# Altium schematic sheet LLC.SchDoc
size 508 x 381 mm
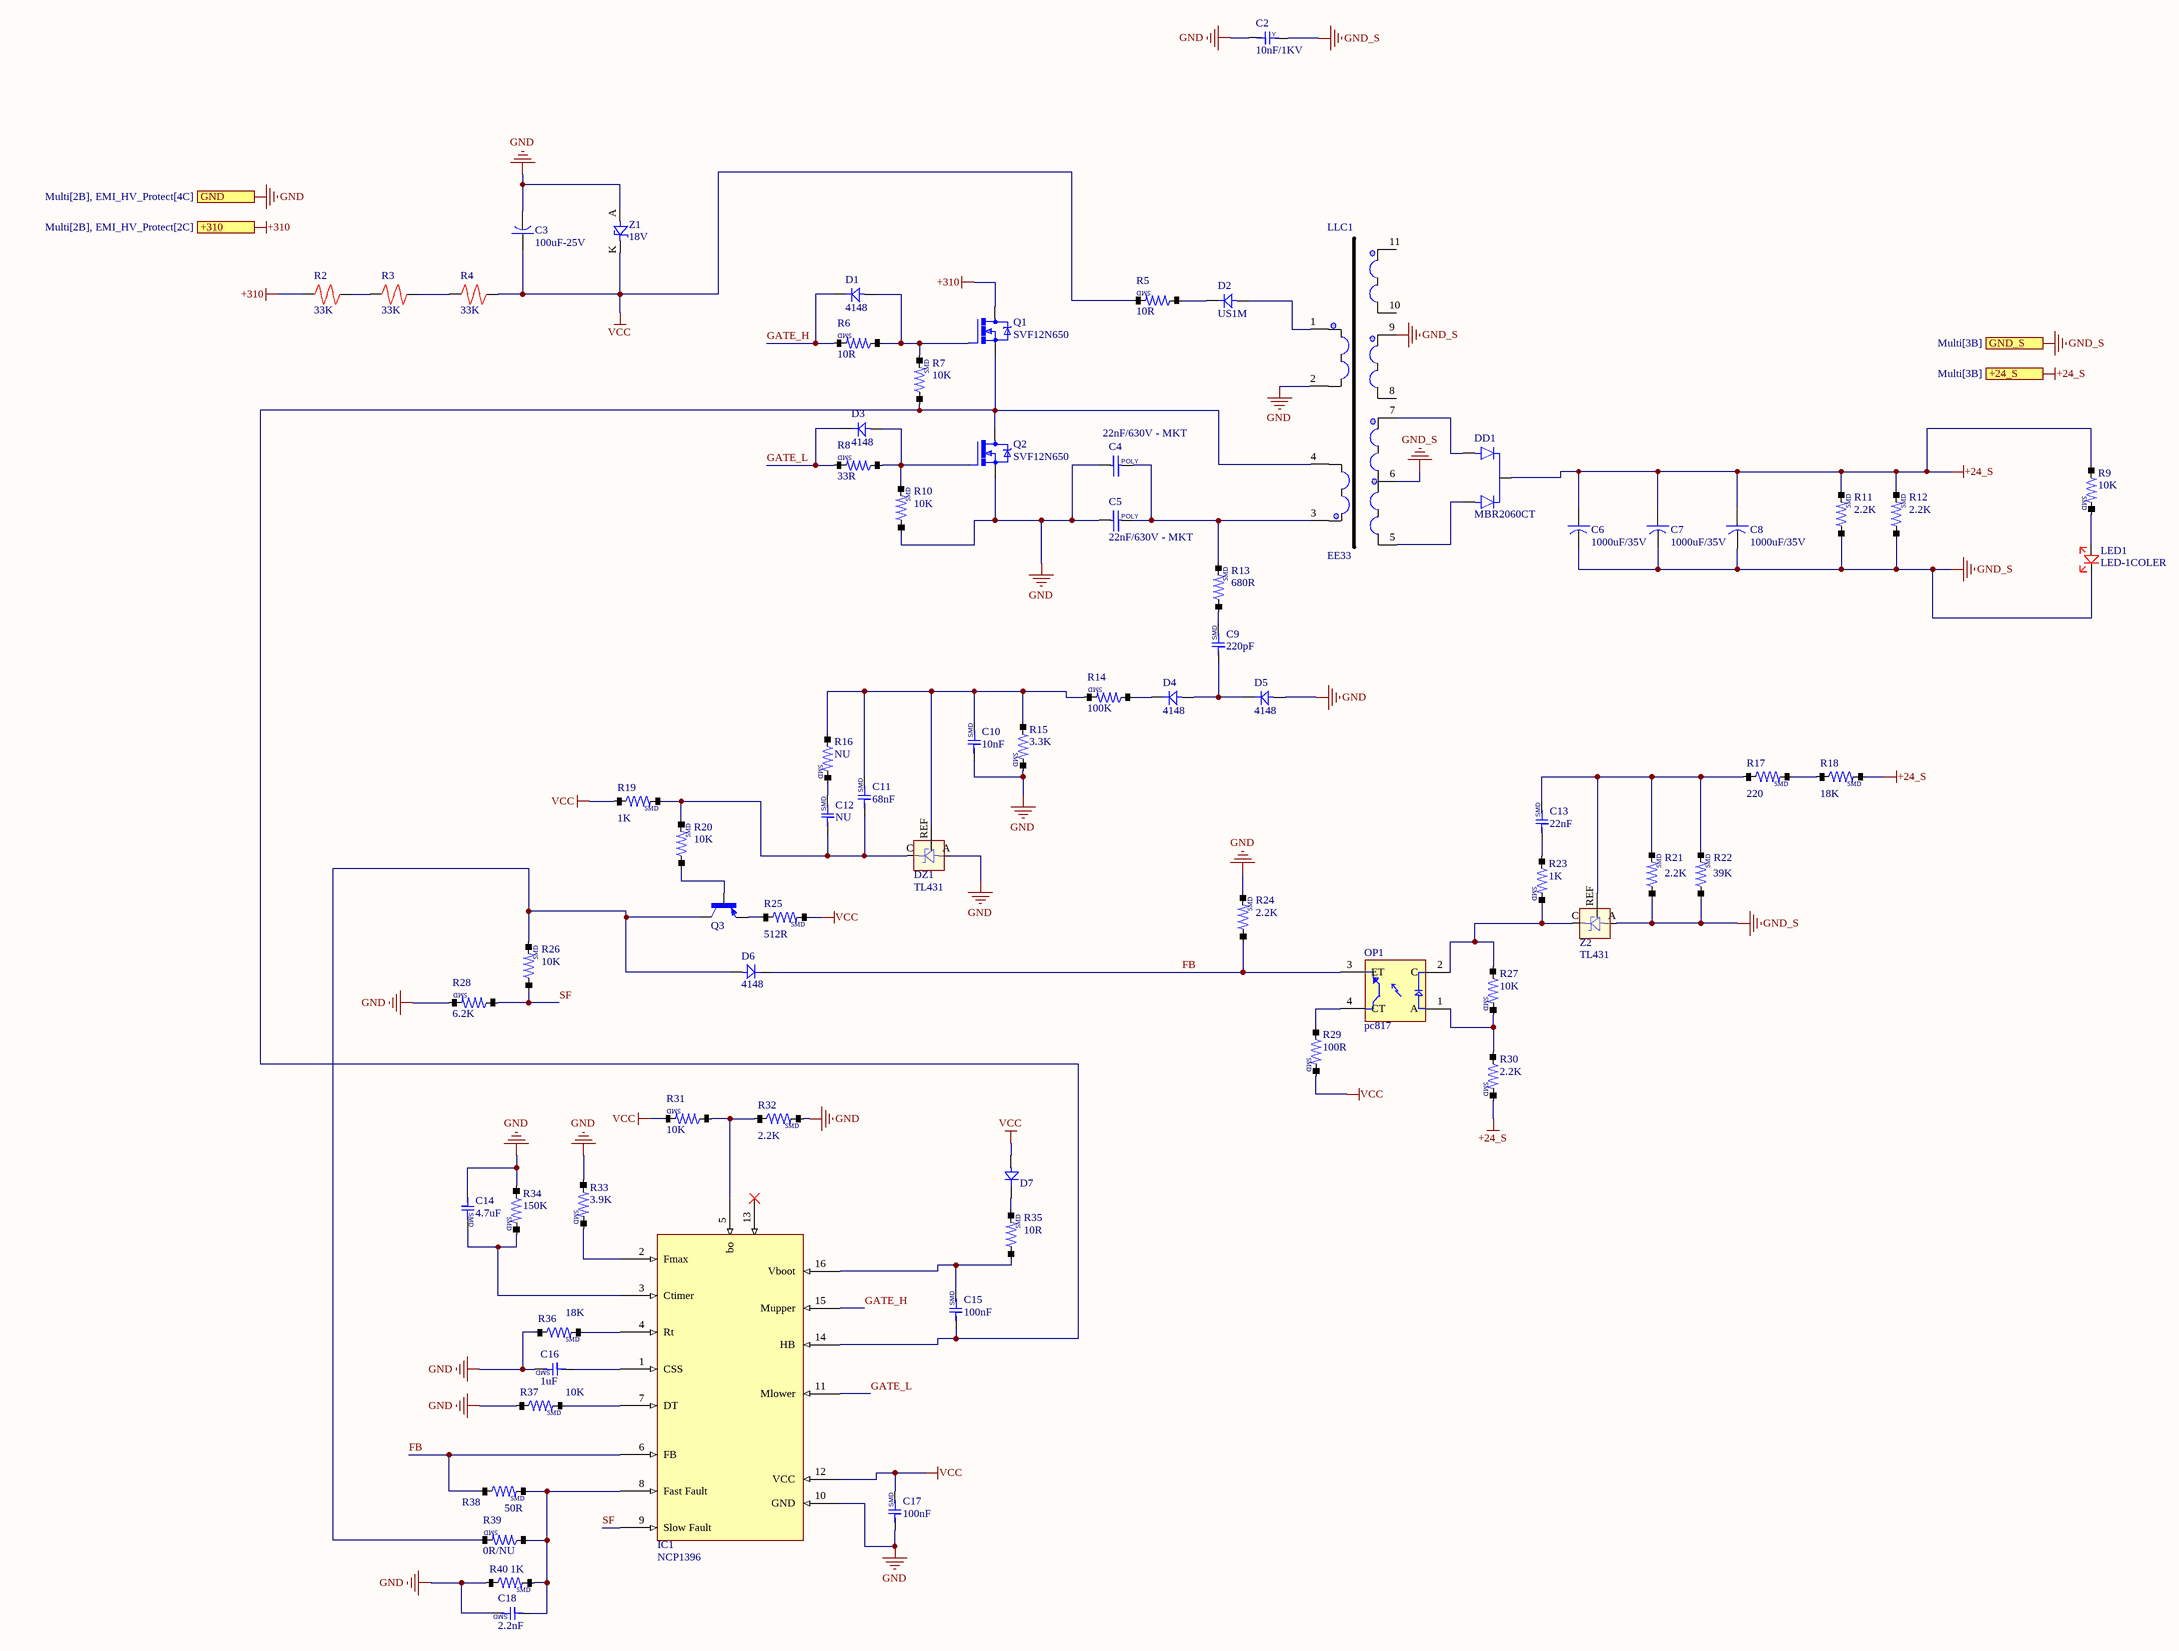
[diagram p0: LLC.SchDoc]

## Parts
C2  10nF/1KV  [CAP_Y_2KV]
C3  100uF-25V  [cap/330u/16v]
C4  22nF/630V - MKT  [CAP-POLY-0.47uF-400V]
C5  22nF/630V - MKT  [CAP-POLY-0.47uF-400V]
C6  1000uF/35V  [CAP-EL_P5MM]
C7  1000uF/35V  [CAP-EL_P5MM]
C8  1000uF/35V  [CAP-EL_P5MM]
C9  220pF  [CAP-0805]
C10  10nF  [CAP-0603]
C11  68nF  [CAP-0603]
C12  NU  [CAP-0603]
C13  22nF  [CAP-0603]
C14  4.7uF  [CAP-0805]
C15  100nF  [CAP-1206]
C16  1uF  [CAP-0805]
C17  100nF  [CAP-0603]
C18  2.2nF  [CAP-0603]
D1  4148  [mini_melf]
D2  US1M  [DIOD/1N4007/SMD]
D3  4148  [mini_melf]
D4  4148  [mini_melf]
D5  4148  [mini_melf]
D6  4148  [mini_melf]
D7  DIOD/RECTIFIERS  [DIOD/1N4007/SMD]  (value not drawn)
DD1  MBR2060CT  [TO220AB]
DZ1  TL431  [TL431]
IC1  NCP1396  [TL494_SMD]
LED1  LED-1COLER  [led/3MM/DIP]
LLC1  EE33  [EE33]
OP1  pc817  [pc817]
Q1  SVF12N650  [TO-220]
Q2  SVF12N650  [TO-220]
Q3  (no value)  [SOT23]
R2  33K  [RES/1W]
R3  33K  [RES/0.25W]
R4  33K  [RES/0.25W]
R5  10R  [RES/1206]
R6  10R  [RES/1206]
R7  10K  [RES/0603]
R8  33R  [RES/1206]
R9  10K  [RES/1206]
R10  10K  [RES/0603]
R11  2.2K  [RES/1206]
R12  2.2K  [RES/1206]
R13  680R  [RES/0603]
R14  100K  [RES/0603]
R15  3.3K  [RES/0603]
R16  NU  [RES/0603]
R17  220  [RES/0603]
R18  18K  [RES/0603]
R19  1K  [RES/0603]
R20  10K  [RES/0603]
R21  2.2K  [RES/0603]
R22  39K  [RES/0603]
R23  1K  [RES/0603]
R24  2.2K  [RES/0603]
R25  512R  [RES/0603]
R26  10K  [RES/0603]
R27  10K  [RES/0603]
R28  6.2K  [RES/0603]
R29  100R  [RES/0603]
R30  2.2K  [RES/0603]
R31  10K  [RES/0603]
R32  2.2K  [RES/0603]
R33  3.9K  [RES/0603]
R34  150K  [RES/0603]
R35  10R  [RES/1206]
R36  18K  [RES/0603]
R37  10K  [RES/0603]
R38  50R  [RES/0603]
R39  0R/NU  [RES/0603]
R40  1K  [RES/0603]
Z1  18V  [DIOD/RS1J]
Z2  TL431  [TL431]

## Ports
+24_S (see Multi[3B]), +310 (see Multi[2B], EMI_HV_Protect[2C]), GND (see Multi[2B], EMI_HV_Protect[4C]), GND_S (see Multi[3B])

## Nets
+24_S: C6.+ C7.+ C8.+ DD1.2(C) R9.1 R11.2 R12.2 R18.2 R30.2 ; port +24_S
+310: Q1.2(D) R2.2 ; port +310
GND: C2.1 C3.- C4.1 C5.1 C10.1 C14.1 C16.2 C17.1 C18.2 D5.A DZ1.A IC1.10(GND) LLC1.2 Q2.3(s) R10.1 R15.2 R24.2 R28.2 R32.2 R33.1 R34.1 R36.1 R37.1 R40.1 Z1.A ; port GND
GND_S: C2.2 C6.- C7.- C8.- LED1.K LLC1.6 LLC1.9 R11.1 R12.1 R21.1 R22.1 Z2.A ; port GND_S
VCC: C3.+ C17.2 D7.A IC1.12(VCC) R4.1 R5.2 R19.1 R25.2 R29.2 R31.2 Z1.K
FB: D6.K IC1.6(FB) OP1.3(ET) R24.1 R38.1
GATE_H: D1.K IC1.15(Mupper) R6.2
GATE_L: D3.K IC1.11(Mlower) R8.2
SF: IC1.9(Slow_Fault) R26.1 R28.1
NetC4_2: C4.2 C5.2 LLC1.3 R13.2
NetC9_1: C9.1 D4.A D5.K
NetC9_2: C9.2 R13.1
NetC10_2: C10.2 C11.2 DZ1.REF R14.2 R15.1 R16.1
NetC11_1: C11.1 C12.1 DZ1.C R19.2 R20.2
NetC12_2: C12.2 R16.2
NetC13_1: C13.1 R23.1
NetC13_2: C13.2 R17.1 R21.2 R22.2 Z2.REF
NetC14_2: C14.2 IC1.3(Ctimer) R34.2
NetC15_1: C15.1 IC1.14(HB) LLC1.4 Q1.3(s) Q2.2(D) R7.1
NetC15_2: C15.2 IC1.16(Vboot) R35.1
NetC16_1: C16.1 IC1.1(CSS)
NetC18_1: C18.1 IC1.8(Fast_Fault) R38.2 R39.1 R40.2
NetD1_A: D1.A Q1.1(G) R6.1 R7.2
NetD2_A: D2.A LLC1.1
NetD2_K: D2.K R5.1
NetD3_A: D3.A Q2.1(G) R8.1 R10.2
NetD4_K: D4.K R14.1
NetD6_A: D6.A Q3.2(C) R26.2 R39.2
NetD7_K: D7.K R35.2
NetDD1_1: DD1.1(A1) LLC1.7
NetDD1_3: DD1.3(A2) LLC1.5
NetIC1_2: IC1.2(Fmax) R33.2
NetIC1_4: IC1.4(Rt) R36.2
NetIC1_5: IC1.5(bo) R31.1 R32.1
NetIC1_7: IC1.7(DT) R37.2
NetLED1_A: LED1.A R9.2
NetOP1_1: OP1.1(A) R27.2 R30.1
NetOP1_2: OP1.2(C) R23.2 R27.1 Z2.C
NetOP1_4: OP1.4(CT) R29.1
NetQ3_1: Q3.1(B) R20.1
NetQ3_3: Q3.3(E) R25.1
NetR2_1: R2.1 R3.2
NetR3_1: R3.1 R4.2
NetR17_2: R17.2 R18.1

Not connected (* = marked no-connect by the designer): IC1 13*; LLC1 8(0) 10(0) 11(0)

## Notes on the sheet
- (in symbol cap-poly) POLY
- (in symbol cap_smd) SMD
- (in symbol CAP_Y) Y
- (in symbol RES/SMD) SMD

## Library data of the parts
C2 = CAP_Y
C3 C6-C8 = cap-electrolit
C4 C5 = cap-poly
C9-C18 = cap_smd
D1-D6 = DIOD/RECTIFIERS
DD1 = DIOD_double
LLC1 = TRANS_RT03_LLC
Q1 Q2 = MOSFET_N_CH
Q3 = PNP
R2-R4 = RES/<1W
R5-R40 = RES/SMD
Z1 = zener-0.5w